# Altium project PCB_Project.PrjPcb
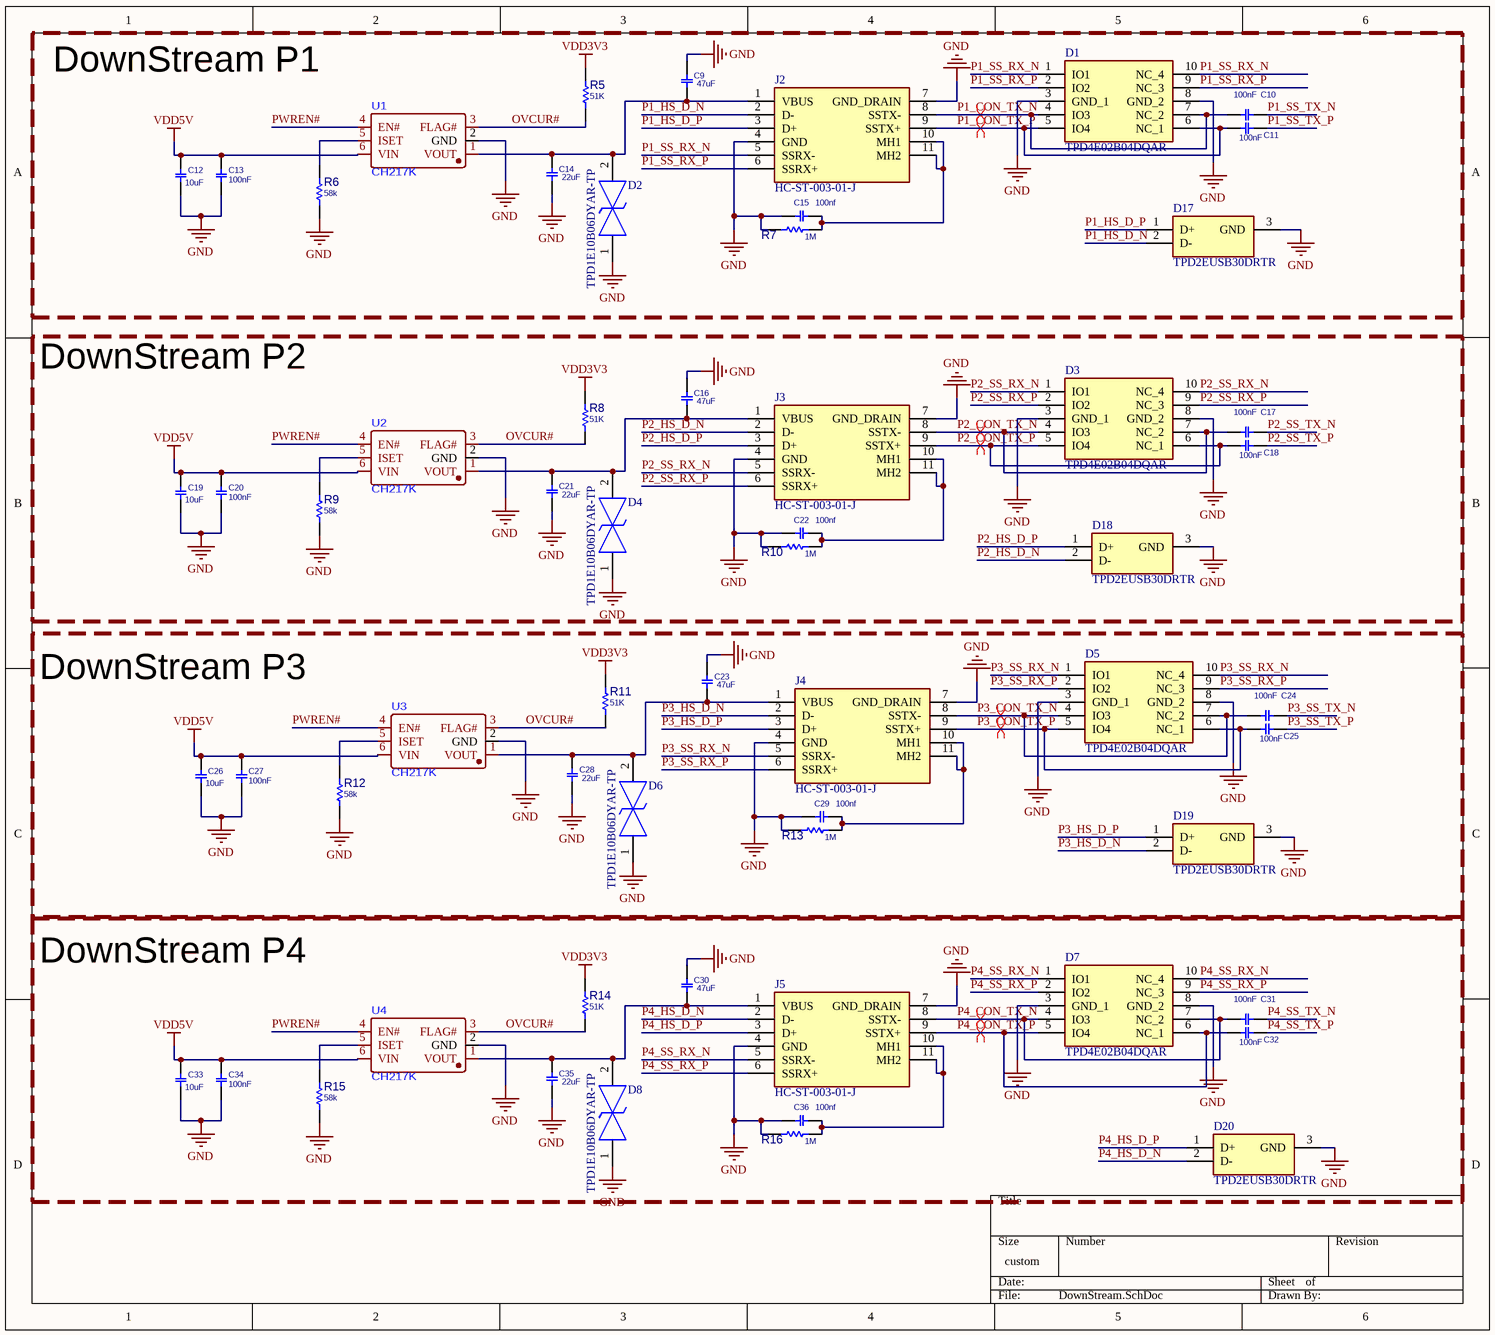
[diagram p0: DownStream.SchDoc]
4 sheets, 134 parts. Net scope: global (net labels, ports and power ports of the same name join across sheets).
Board file: PCB1.PcbDoc
Sheets:
  DownStream.SchDoc
  Power Management.SchDoc
  CH634W6G.SchDoc
  UpStream.SchDoc

## Sheet DownStream.SchDoc
size 279 x 248 mm; SheetNumber: 1; SheetTotal: 4

### Parts
C9  47uF  [C0805]
C10  100nF  [C0402]
C11  100nF  [C0402]
C12  10uF  [C0603]
C13  100nF  [C0402]
C14  22uF  [C0805]
C15  100nf  [C1812]
C16  47uF  [C0805]
C17  100nF  [C0402]
C18  100nF  [C0402]
C19  10uF  [C0603]
C20  100nF  [C0402]
C21  22uF  [C0805]
C22  100nf  [C1812]
C23  47uF  [C0805]
C24  100nF  [C0402]
C25  100nF  [C0402]
C26  10uF  [C0603]
C27  100nF  [C0402]
C28  22uF  [C0805]
C29  100nf  [C1812]
C30  47uF  [C0805]
C31  100nF  [C0402]
C32  100nF  [C0402]
C33  10uF  [C0603]
C34  100nF  [C0402]
C35  22uF  [C0805]
C36  100nf  [C1812]
D1  TPD4E02B04DQAR  [DQA(R-PUSON-N10)]
D2  TPD1E10B06DYAR-TP  [SODFL1608X77N]
D3  TPD4E02B04DQAR  [DQA(R-PUSON-N10)]
D4  TPD1E10B06DYAR-TP  [SODFL1608X77N]
D5  TPD4E02B04DQAR  [DQA(R-PUSON-N10)]
D6  TPD1E10B06DYAR-TP  [SODFL1608X77N]
D7  TPD4E02B04DQAR  [DQA(R-PUSON-N10)]
D8  TPD1E10B06DYAR-TP  [SODFL1608X77N]
D17  TPD2EUSB30DRTR  [SOTFL35P100X50-3N]
D18  TPD2EUSB30DRTR  [SOTFL35P100X50-3N]
D19  TPD2EUSB30DRTR  [SOTFL35P100X50-3N]
D20  TPD2EUSB30DRTR  [SOTFL35P100X50-3N]
J2  HC-ST-003-01-J  [GSB4111312HR]
J3  HC-ST-003-01-J  [GSB4111312HR]
J4  HC-ST-003-01-J  [GSB4111312HR]
J5  HC-ST-003-01-J  [GSB4111312HR]
R5  51K  [R0402]
R6  58k  [R0402]
R7  1M  [R0805]
R8  51K  [R0402]
R9  58k  [R0402]
R10  1M  [R0805]
R11  51K  [R0402]
R12  58k  [R0402]
R13  1M  [R0805]
R14  51K  [R0402]
R15  58k  [R0402]
R16  1M  [R0805]
U1  CH217K  [IC_IC-DP_SOT23-6L]
U2  CH217K  [IC_IC-DP_SOT23-6L]
U3  CH217K  [IC_IC-DP_SOT23-6L]
U4  CH217K  [IC_IC-DP_SOT23-6L]

### Blocks framed on the sheet
DownStream P1: C9-C15 D1 D2 D17 J2 R5-R7 U1
DownStream P2: C16-C22 D3 D4 D18 J3 R8-R10 U2
DownStream P3: C23-C29 D5 D6 D19 J4 R11-R13 U3
DownStream P4: C30-C36 D7 D8 D20 J5 R14-R16 U4

### Nets
GND: C9.2 C12.1 C13.2 C14.1 C15.1 C16.2 C19.1 C20.2 C21.1 C22.1 C23.2 C26.1 C27.2 C28.1 C29.1 C30.2 C33.1 C34.2 C35.1 C36.1 D1.3(GND_1) D1.8(GND_2) D2.1 D3.3(GND_1) D3.8(GND_2) D4.1 D5.3(GND_1) D5.8(GND_2) D6.1 D7.3(GND_1) D7.8(GND_2) D8.1 D17.3(GND) D18.3(GND) D19.3(GND) D20.3(GND) J2.4(GND) J2.7(GND_DRAIN) J3.4(GND) J3.7(GND_DRAIN) J4.4(GND) J4.7(GND_DRAIN) J5.4(GND) J5.7(GND_DRAIN) R6.2 R7.2 R9.2 R10.2 R12.2 R13.2 R15.2 R16.2 U1.2(GND) U2.2(GND) U3.2(GND) U4.2(GND)
VDD3V3: R5.1 R8.1 R11.1 R14.1  [project net AVDD3V3]
VDD5V: C12.2 C13.1 C19.2 C20.1 C26.2 C27.1 C33.2 C34.1 U1.6(VIN) U2.6(VIN) U3.6(VIN) U4.6(VIN)
OVCUR#: R5.2 R8.2 R11.2 R14.2 U1.3(FLAG#) U2.3(FLAG#) U3.3(FLAG#) U4.3(FLAG#)
P1_CON_TX_N: C10.2 D1.4(IO3) D1.7(NC_2) J2.8(SSTX-)
P1_CON_TX_P: C11.2 D1.5(IO4) D1.6(NC_1) J2.9(SSTX+)
P1_HS_D_N: D17.2(D-) J2.2(D-)
P1_HS_D_P: D17.1(D+) J2.3(D+)
P1_SS_RX_N: D1.1(IO1) D1.10(NC_4) J2.5(SSRX-)
P1_SS_RX_P: D1.2(IO2) D1.9(NC_3) J2.6(SSRX+)
P1_SS_TX_N: C10.1
P1_SS_TX_P: C11.1
P2_CON_TX_N: C17.2 D3.4(IO3) D3.7(NC_2) J3.8(SSTX-)
P2_CON_TX_P: C18.2 D3.5(IO4) D3.6(NC_1) J3.9(SSTX+)
P2_HS_D_N: D18.2(D-) J3.2(D-)
P2_HS_D_P: D18.1(D+) J3.3(D+)
P2_SS_RX_N: D3.1(IO1) D3.10(NC_4) J3.5(SSRX-)
P2_SS_RX_P: D3.2(IO2) D3.9(NC_3) J3.6(SSRX+)
P2_SS_TX_N: C17.1
P2_SS_TX_P: C18.1
P3_CON_TX_N: C24.2 D5.4(IO3) D5.7(NC_2) J4.8(SSTX-)
P3_CON_TX_P: C25.2 D5.5(IO4) D5.6(NC_1) J4.9(SSTX+)
P3_HS_D_N: D19.2(D-) J4.2(D-)
P3_HS_D_P: D19.1(D+) J4.3(D+)
P3_SS_RX_N: D5.1(IO1) D5.10(NC_4) J4.5(SSRX-)
P3_SS_RX_P: D5.2(IO2) D5.9(NC_3) J4.6(SSRX+)
P3_SS_TX_N: C24.1
P3_SS_TX_P: C25.1
P4_CON_TX_N: C31.2 D7.4(IO3) D7.7(NC_2) J5.8(SSTX-)
P4_CON_TX_P: C32.2 D7.5(IO4) D7.6(NC_1) J5.9(SSTX+)
P4_HS_D_N: D20.2(D-) J5.2(D-)
P4_HS_D_P: D20.1(D+) J5.3(D+)
P4_SS_RX_N: D7.1(IO1) D7.10(NC_4) J5.5(SSRX-)
P4_SS_RX_P: D7.2(IO2) D7.9(NC_3) J5.6(SSRX+)
P4_SS_TX_N: C31.1
P4_SS_TX_P: C32.1
PWREN#: U1.4(EN#) U2.4(EN#) U3.4(EN#) U4.4(EN#)
NetC9_1: C9.1 C14.2 D2.2 J2.1(VBUS) U1.1(VOUT)
NetC15_2: C15.2 J2.10(MH1) J2.11(MH2) R7.1
NetC16_1: C16.1 C21.2 D4.2 J3.1(VBUS) U2.1(VOUT)
NetC22_2: C22.2 J3.10(MH1) J3.11(MH2) R10.1
NetC23_1: C23.1 C28.2 D6.2 J4.1(VBUS) U3.1(VOUT)
NetC29_2: C29.2 J4.10(MH1) J4.11(MH2) R13.1
NetC30_1: C30.1 C35.2 D8.2 J5.1(VBUS) U4.1(VOUT)
NetC36_2: C36.2 J5.10(MH1) J5.11(MH2) R16.1
NetR6_1: R6.1 U1.5(ISET)
NetR9_1: R9.1 U2.5(ISET)
NetR12_1: R12.1 U3.5(ISET)
NetR15_1: R15.1 U4.5(ISET)

### Layout directives
differential pair; net class SupperSpeed; rule Differential Pairs Routing [Pref Gap = 5mil    Min Gap  = 5mil    Max Gap  = 5milPref Width = 4.347mil    Min Width  = 2.255mil    Max Width  = 4.347mil]: P1_CON_TX_N, P1_CON_TX_P, P2_CON_TX_N, P2_CON_TX_P, P3_CON_TX_N, P3_CON_TX_P, P4_CON_TX_N, P4_CON_TX_P

### Library data of the parts
C9 C14 C16 C21 C23 C28 C30 C35 = CAP_SMD_MLCC_0805
C10 C11 C13 C17 C18 C20 C24 C25 C27 C31 C32 C34 = CAP_SMD_MLCC_0402
C12 C19 C33 = CAP_SMD_MLCC_0603: CAP, MLCC, -F, -V, MATERIAL, -%, 0201
C15 C22 C29 C36 = CAP_SMD_MLCC_1812: +1kv 100nf
C26 = CAP_SMD_MLCC_0603
D1 D3 D5 D7 = TPD4E02B04DQAR: Diode; Manufacturer_Name: Texas Instruments; Datasheet Link: http://www.ti.com/lit/gpn/tpd4e02b04; Manufacturer_Part_Number: TPD4E02B04DQAR; Mouser Part Number: 595-TPD4E02B04DQAR; Mouser Price/Stock: https://www.mouser.co.uk/ProductDetail/Texas-Instruments/TPD4E02B04DQAR?qs=8%2FmU9qzJpL%2FFVYtHO1iV9g%3D%3D; Arrow Part Number: TPD4E02B04DQAR; Arrow Price/Stock: https://www.arrow.com/en/products/tpd4e02b04dqar/texas-instruments?utm_currency=USD&region=nac
D2 D4 D6 D8 = TPD1E10B06DYARQ1: TVS Diode (Bi-directional); Manufacturer_Name: Texas Instruments; Datasheet Link: https://www.ti.com/lit/ds/symlink/tpd1e10b06-q1.pdf?ts=1647960520558&ref_url=https%253A%252F%252Fwww.ti.com%252Fstore%252Fti%252Fen%252Fp%252Fproduct%252F%253Fp%253DTPD1E10B06DYARQ1%2526keyMatch%253DTPD1E10B06DYARQ1%2526tisearch%253Dsearch-everything%2526; Height: 0.77mm; Manufacturer_Part_Number: TPD1E10B06DYARQ1; Mouser Part Number: 595-TPD1E10B06DYARQ1; Mouser Price/Stock: https://www.mouser.co.uk/ProductDetail/Texas-Instruments/TPD1E10B06DYARQ1?qs=MyNHzdoqoQLC7lMK0t36jg%3D%3D; Arrow Part Number: TPD1E10B06DYARQ1; Arrow Price/Stock: https://www.arrow.com/en/products/tpd1e10b06dyarq1/texas-instruments.html?utm_currency=USD&region=nac
D17-D20 = TPD2EUSB30DRTR: TPD2EUSB30ADRTR; Manufacturer_Name: Texas Instruments; Datasheet Link: https://datasheet.datasheetarchive.com/originals/distributors/SFDatasheet-11/sf-000234749.pdf; Height: 0.5mm; Manufacturer_Part_Number: TPD2EUSB30DRTR; Mouser Part Number: 595-TPD2EUSB30DRTR; Mouser Price/Stock: https://www.mouser.co.uk/ProductDetail/Texas-Instruments/TPD2EUSB30DRTR?qs=%2Fqzd9s%252BcLd6bPJi5HXCDvw%3D%3D; Arrow Part Number: TPD2EUSB30DRTR; Arrow Price/Stock: https://www.arrow.com/en/products/tpd2eusb30drtr/texas-instruments?utm_currency=USD&region=nac
J2-J5 = GSB4111312HR: Connector; Manufacturer_Name: HCTL; Datasheet Link: https://jlc-prod-smt.oss-eu-central-1.aliyuncs.com/smtDataManualFile/8588944600697987072-C2845330.pdf?response-content-disposition=attachment%3B%20filename%3DC2845330.pdf%3B%20filename%2A%3DUTF-8%27%27C2845330.pdf&x-oss-date=20260624T131613Z&x-oss-expires=1800&x-oss-security-token=CAISgAN1q6Ft5B2yfSjIr5neLuyMobBX8Jq8VFL3t04ybct22oPs1Tz2IHhMdHJsAOodtv0%2FmmhT6PkclqRLcbhpcmfjV%2BZHzLB8qfh56zJG4J7b16cNrbH4M4H6aXeirtuwDsz9SNTCALjPD3nPii50x5bjaDymRCbLGJaViJlhHLN1Ow6jdmhpCctxLAlvo9NgFxm3D%2Fu2NQPwiWf9FVdhvhEG6Vly8qOi2MaRmFy8yFTx0b0SvJ%2BjYMrmPctoN9JnSdC5mfdzau3a1TJ84gRD0a5wkaVA1zbDs5bfISEIuUzebreLqY03dV4mOvdqIcMe8qigz88fk%2FfIioH6xyxKOexoSCnFTOiiupCcQLPyao9jLu6iayqViY7QaIOTqQohZmkAMwVOasAsI3Ngh4zF97Qt0cVNkXO9gWfLI8DtuMleWmrhyvhZYnSgc5lCkRRYwGs1287ugXlSQzo890KPDAEovaKCnZ2ZSfh7Y4sNknI6i%2Bfc2Se2MIkIaGg6%2BaKWD5sagAGaU2vJ%2BUbHVcuInMWet0dEX2Iv7ftV1FJ3rlSjwZii9OyhGbJCZVYvIkQRaKGMI1tb%2BXiUsWCR1GdB305w4Pj9RGYZ3q2pJnyDZ5Gd2q%2FQL%2Byrus7VegFb%2FfVgXDtlbRo3gaGxstKJLtvMuu%2FTomt3hknP3Pb5omGW5yvr9zftiSAA&x-oss-signature-version=OSS4-HMAC-SHA256&x-oss-credential=STS.NZkeV8LovGXWVtFSNgaDZ5FG7%2F20260624%2Feu-central-1%2Foss%2Faliyun_v4_request&x-oss-signature=348679cb6c752d500094aba1cae5179e4d919bc3f1e2f01c465e7868dab20983; Height: 7.94mm; Manufacturer_Part_Number: HC-ST-003-01-J
R5-R16 = RES_SMD_0402: RESISTOR, SMD

## Sheet Power Management.SchDoc
size A; SheetNumber: 2; SheetTotal: 4
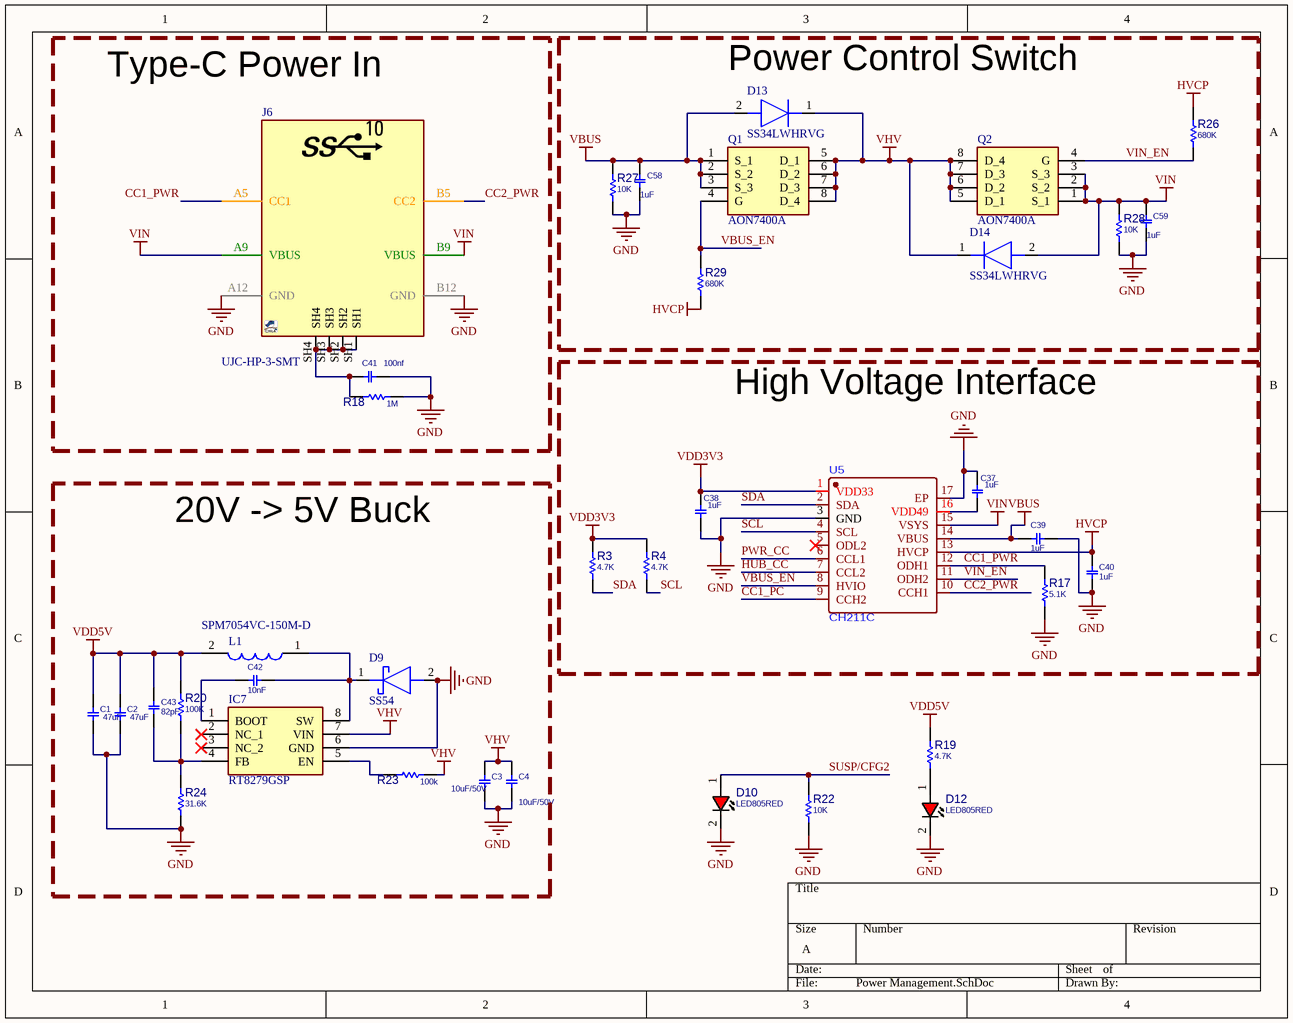
[diagram p1: Power Management.SchDoc]

### Parts
C1  47uF  [C0805]
C2  47uF  [C0805]
C3  10uF/50V  [C0805]
C4  10uF/50V  [C0805]
C37  1uF  [C0805]
C38  1uF  [C0805]
C39  1uF  [C0805]
C40  1uF  [C0805]
C41  100nf  [C1812]
C42  10nF  [C0402]
C43  82pF  [C0402]
C58  1uF  [C0402]
C59  1uF  [C0402]
D9  SS54  [DIOM5026X262N]
D10  LED805RED  [LED0805RED]
D12  LED805RED  [LED0805RED]
D13  SS34LWHRVG  [SODFL3718X102N]
D14  SS34LWHRVG  [SODFL3718X102N]
IC7  RT8279GSP  [SOIC127P600X175-8N]
J6  UJC-HP-3-SMT  [USBC_SMD_6_UJCHP3SMT]
L1  SPM7054VC-150M-D  [SPM7054VC150MD]
Q1  AON7400A  [DFN_3X3_EP]
Q2  AON7400A  [DFN_3X3_EP]
R3  4.7K  [R0402]
R4  4.7K  [R0402]
R17  5.1K  [R0402]
R18  1M  [R0805]
R19  4.7K  [R0402]
R20  100K  [R0402]
R22  10K  [R0402]
R23  100k  [R0402]
R24  31.6K  [R0402]
R26  680K  [R0402]
R27  10K  [R0402]
R28  10K  [R0402]
R29  680K  [R0402]
U5  CH211C  [QFN-16C_L2.0-W2.0-P0.40-BL-EP1.2]

### Blocks framed on the sheet
Type-C Power In: C41 J6 R18
Power Control Switch: C58 C59 D13 D14 Q1 Q2 R26-R29
High Voltage Interface: C37-C40 R3 R4 R17 U5
20V -> 5V Buck: C1-C4 C42 C43 D9 IC7 L1 R20 R23 R24

### Nets
GND: C1.1 C2.1 C3.1 C4.1 C37.2 C38.1 C39.1 C40.2 C41.2 C58.1 C59.1 D9.2(A) D10.2(CATHODE) D12.2(CATHODE) IC7.6(GND) J6.A12(GND) J6.B12(GND) R17.2 R18.1 R22.2 R24.2 R27.2 R28.2 U5.3(GND) U5.17(EP)
HVCP: C40.1 R26.2 R29.2 U5.13(HVCP)
VBUS: C39.2 C58.2 D13.2(A) Q1.1(S_1) Q1.2(S_2) Q1.3(S_3) R27.1 U5.14(VBUS)
VDD3V3: C38.2 R3.1 R4.1 U5.1(VDD33)  [project net AVDD3V3]
VDD5V: C1.2 C2.2 C43.1 L1.2 R19.1 R20.1
VHV: C3.2 C4.2 D13.1(K) D14.1(K) IC7.7(VIN) Q1.5(D_1) Q1.6(D_2) Q1.7(D_3) Q1.8(D_4) Q2.5(D_1) Q2.6(D_2) Q2.7(D_3) Q2.8(D_4) R23.1
VIN: C59.2 D14.2(A) J6.A9(VBUS) J6.B9(VBUS) Q2.1(S_1) Q2.2(S_2) Q2.3(S_3) R28.1 U5.15(VSYS)
CC1_PC: U5.9(CCH2)
CC1_PWR: J6.A5(CC1) R17.1 U5.12(ODH1)
CC2_PWR: J6.B5(CC2) U5.10(CCH1)
HUB_CC: U5.7(CCL2)
PWR_CC: U5.6(CCL1)
SCL: R4.2 U5.4(SCL)
SDA: R3.2 U5.2(SDA)
SUSP/CFG2: D10.1(ANODE) R22.1
VBUS_EN: Q1.4(G) R29.1 U5.8(HVIO)
VIN_EN: Q2.4(G) R26.1 U5.11(ODH2)
NetC37_1: C37.1 U5.16(VDD49)
NetC41_1: C41.1 J6.SH1 J6.SH2 J6.SH3 J6.SH4 R18.2
NetC42_1: C42.1 D9.1(K) IC7.8(SW) L1.1
NetC42_2: C42.2 IC7.1(BOOT)
NetC43_2: C43.2 IC7.4(FB) R20.2 R24.1
NetD12_1: D12.1(ANODE) R19.2
NetIC7_5: IC7.5(EN) R23.2

Not connected (* = marked no-connect by the designer): IC7 2(NC_1)* 3(NC_2)*; U5 5(ODL2)*

### Library data of the parts
C1-C3 C37-C40 = CAP_SMD_MLCC_0805
C4 = CAP_SMD_MLCC_0402: 50V
C41 = CAP_SMD_MLCC_1812: +1kv 100nf
C42 C43 C58 C59 = CAP_SMD_MLCC_0402
D9 = SS54: Schottky Diode; Manufacturer_Name: DIYI Elec Tech; Datasheet Link: https://datasheet.lcsc.com/szlcsc/DIYI-Elec-Tech-SS54_C84165.pdf; Height: 2.62mm; Manufacturer_Part_Number: SS54
D10 D12 = LED_SMD_0805_RED: LED, SMD, 0805, RED; DESC: DESCRIPTION; MANF_P#: MANF_PART#; PARAM2: 2.2V; MANF: MANF; ASSEMBLY: ASSEMBLY; PRICE: 36t@Javan; VALUE: LED805RED
D13 D14 = SS34LWHRVG: Diode; Manufacturer_Name: Taiwan Semiconductor; Datasheet Link: https://datasheet.datasheetarchive.com/originals/distributors/DKDS-20/389381.pdf; Height: 1.02mm; Manufacturer_Part_Number: SS34LWHRVG; Mouser Part Number: 821-SS34LWHRVG; Mouser Price/Stock: https://www.mouser.co.uk/ProductDetail/Taiwan-Semiconductor/SS34LWHRVG?qs=5aG0NVq1C4zYvYQjFNyRbA%3D%3D; Arrow Part Number: SS34LWHRVG; Arrow Price/Stock: https://www.arrow.com/en/products/ss34lwhrvg/taiwan-semiconductor?region=asia
IC7 = RT8279GSP: Integrated Circuit; Manufacturer_Name: RICHTEK; Datasheet Link: https://www.richtek.com/assets/product_file/RT8279/DS8279-01.pdf; Height: 1.753mm; Manufacturer_Part_Number: RT8279GSP
J6 = CONN_USBC_SMD_6_UJC-HP-3-SMT: CONN, USB, Type C (USB 3.1), Right-Angle, SMD; MANF: CUI Devices; PARAM2: 20v; PARAM: Power Only, 3A; Price: 0.8$; MANF_P#: UJC-HP-3-SMT; Value: UJC-HP-3-SMT
L1 = SPM7054VC-150M-D: Inductor; Manufacturer_Name: TDK; Datasheet Link: https://product.tdk.com/system/files/dam/doc/product/inductor/inductor/smd/catalog/inductor_automotive_power_spm7054vc-d_en.pdf; Height: 5.4mm; Manufacturer_Part_Number: SPM7054VC-150M-D; Mouser Part Number: 810-SPM7054VC-150M-D; Mouser Price/Stock: https://www.mouser.co.uk/ProductDetail/TDK/SPM7054VC-150M-D?qs=t7xnP681wgUXhSKXG3H9TA%3D%3D
Q1 Q2 = AON7400A: MOSFET (N-Channel); Manufacturer_Name: Alpha & Omega Semiconductors; Datasheet Link: https://www.arrow.com/en/products/aon7400a/alpha-and-omega-semiconductor; Manufacturer_Part_Number: AON7400A; Arrow Part Number: AON7400A; Arrow Price/Stock: https://www.arrow.com/en/products/aon7400a/alpha-and-omega-semiconductor.html?utm_currency=USD&region=nac
R3 R4 R17 R19 R20 R22-R24 R26-R29 = RES_SMD_0402: RESISTOR, SMD
R18 = RES_SMD_0402: RESISTOR, SMD / 0805

## Sheet CH634W6G.SchDoc
size A4; SheetNumber: 3; SheetTotal: 4
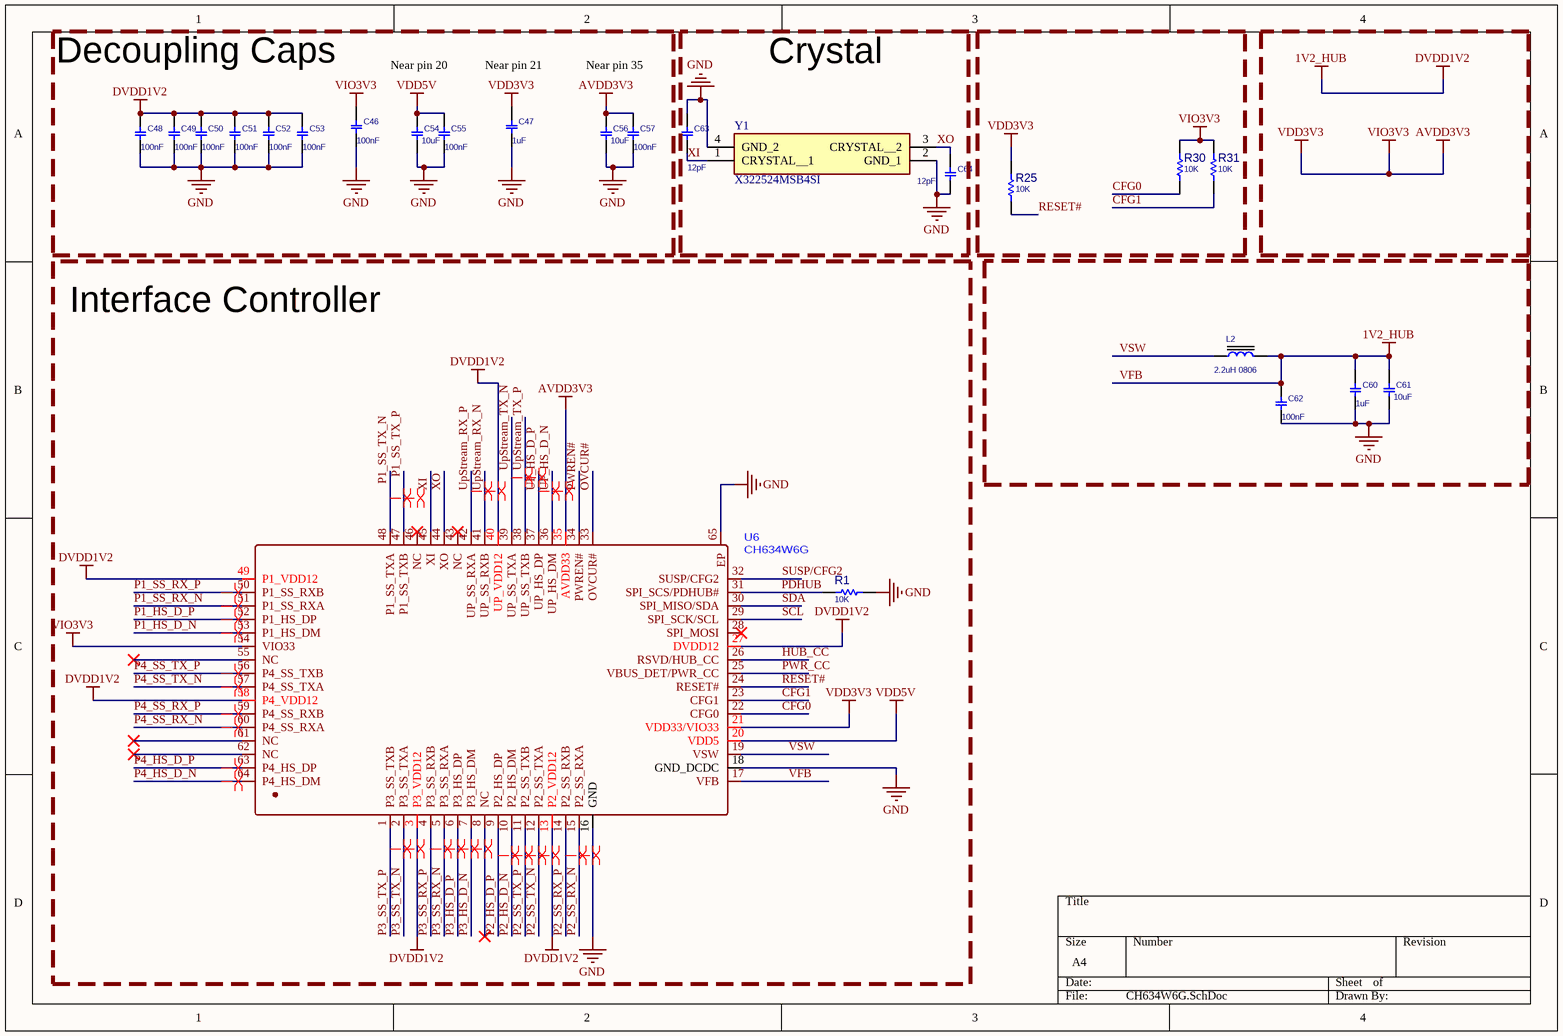
[diagram p2: CH634W6G.SchDoc]

### Parts
C46  100nF  [C0402]
C47  1uF  [C0402]
C48  100nF  [C0402]
C49  100nF  [C0402]
C50  100nF  [C0402]
C51  100nF  [C0402]
C52  100nF  [C0402]
C53  100nF  [C0402]
C54  10uF  [C0603]
C55  100nF  [C0402]
C56  10uF  [C0603]
C57  100nF  [C0402]
C60  1uF  [C0402]
C61  10uF  [C0603]
C62  100nF  [C0402]
C63  12pF  [C0402]
C64  12pF  [C0402]
L2  2.2uH 0806  [L0806]
R1  10K  [R0402]
R25  10K  [R0402]
R30  10K  [R0402]
R31  10K  [R0402]
U6  CH634W6G  [CH634w]
Y1  X322524MSB4SI  [X1E0000210264]

### Blocks framed on the sheet
Decoupling Caps: C46-C57
Crystal: C63 C64 Y1
Interface Controller: R1 U6

### Nets
AVDD3V3: C46.2 C47.2 C56.2 C57.2 R25.1 R30.1 R31.1 U6.21(VDD33/VIO33) U6.35(AVDD33) U6.54(VIO33)  [also labelled VDD3V3, VIO3V3]
GND: C46.1 C47.1 C48.1 C49.1 C50.1 C51.1 C52.1 C53.1 C54.1 C55.1 C56.1 C57.1 C60.1 C61.1 C62.1 C63.2 C64.2 R1.2 U6.16(GND) U6.18(GND_DCDC) U6.65(EP) Y1.2(GND_1) Y1.4(GND_2)
VDD5V: C54.2 C55.2 U6.20(VDD5)
VFB: C48.2 C49.2 C50.2 C51.2 C52.2 C53.2 C60.2 C61.2 C62.2 L2.2 U6.3(P3_VDD12) U6.13(P2_VDD12) U6.17(VFB) U6.27(DVDD12) U6.40(UP_VDD12) U6.49(P1_VDD12) U6.58(P4_VDD12)  [also labelled 1V2_HUB, DVDD1V2]
CFG0: R30.2 U6.22(CFG0)
CFG1: R31.2 U6.23(CFG1)
HUB_CC: U6.26(RSVD/HUB_CC)
OVCUR#: U6.33(OVCUR#)
P1_HS_D_N: U6.53(P1_HS_DM)
P1_HS_D_P: U6.52(P1_HS_DP)
P1_SS_RX_N: U6.51(P1_SS_RXA)
P1_SS_RX_P: U6.50(P1_SS_RXB)
P1_SS_TX_N: U6.48(P1_SS_TXA)
P1_SS_TX_P: U6.47(P1_SS_TXB)
P2_HS_D_N: U6.10(P2_HS_DM)
P2_HS_D_P: U6.9(P2_HS_DP)
P2_SS_RX_N: U6.15(P2_SS_RXA)
P2_SS_RX_P: U6.14(P2_SS_RXB)
P2_SS_TX_N: U6.12(P2_SS_TXA)
P2_SS_TX_P: U6.11(P2_SS_TXB)
P3_HS_D_N: U6.7(P3_HS_DM)
P3_HS_D_P: U6.6(P3_HS_DP)
P3_SS_RX_N: U6.5(P3_SS_RXA)
P3_SS_RX_P: U6.4(P3_SS_RXB)
P3_SS_TX_N: U6.2(P3_SS_TXA)
P3_SS_TX_P: U6.1(P3_SS_TXB)
P4_HS_D_N: U6.64(P4_HS_DM)
P4_HS_D_P: U6.63(P4_HS_DP)
P4_SS_RX_N: U6.60(P4_SS_RXA)
P4_SS_RX_P: U6.59(P4_SS_RXB)
P4_SS_TX_N: U6.57(P4_SS_TXA)
P4_SS_TX_P: U6.56(P4_SS_TXB)
PDHUB: R1.1 U6.31(SPI_SCS/PDHUB#)
PWR_CC: U6.25(VBUS_DET/PWR_CC)
PWREN#: U6.34(PWREN#)
RESET#: R25.2 U6.24(RESET#)
SCL: U6.29(SPI_SCK/SCL)
SDA: U6.30(SPI_MISO/SDA)
SUSP/CFG2: U6.32(SUSP/CFG2)
UP_HS_D_N: U6.36(UP_HS_DM)
UP_HS_D_P: U6.37(UP_HS_DP)
UpStream_RX_N: U6.41(UP_SS_RXB)
UpStream_RX_P: U6.42(UP_SS_RXA)
UpStream_TX_N: U6.39(UP_SS_TXA)
UpStream_TX_P: U6.38(UP_SS_TXB)
VSW: L2.1 U6.19(VSW)
XI: C63.1 U6.45(XI) Y1.1(CRYSTAL__1)
XO: C64.1 U6.44(XO) Y1.3(CRYSTAL__2)

Not connected (* = marked no-connect by the designer): U6 8(NC)* 28(SPI_MOSI)* 43(NC)* 46(NC)* 55(NC)* 61(NC)* 62(NC)*

### Layout directives
differential pair; rule Differential Pairs Routing [Pref Gap = 5mil    Min Gap  = 5mil    Max Gap  = 5milPref Width = 4.347mil    Min Width  = 2.255mil    Max Width  = 4.347mil]; differential pair class SuperSpeed: P1_HS_D_N, P1_HS_D_P, P1_SS_RX_N, P1_SS_RX_P, P1_SS_TX_N, P1_SS_TX_P, P2_HS_D_N, P2_HS_D_P, P2_SS_RX_N, P2_SS_RX_P, P2_SS_TX_N, P2_SS_TX_P, P3_HS_D_N, P3_HS_D_P, P3_SS_RX_N, P3_SS_RX_P, P3_SS_TX_N, P3_SS_TX_P, P4_HS_D_N, P4_HS_D_P, P4_SS_RX_N, P4_SS_RX_P, P4_SS_TX_N, P4_SS_TX_P, UP_HS_D_N, UP_HS_D_P, UpStream_RX_N, UpStream_RX_P, UpStream_TX_N, UpStream_TX_P

### Notes on the sheet
- Near pin 20
- Near pin 21
- Near pin 35

### Library data of the parts
C46-C53 C55 C57 C60 C62-C64 = CAP_SMD_MLCC_0402
C54 C56 C61 = CAP_SMD_MLCC_0603
L2 = IND_SMD_1uH_2.3A_0806: SLW201610S2R2MST
R1 R25 R30 R31 = RES_SMD_0402: RESISTOR, SMD
Y1 = X1E0000210264: Crystal or Oscillator; Manufacturer_Part_Number: X322524MSB4SI

## Sheet UpStream.SchDoc
size A; SheetNumber: 4; SheetTotal: 4
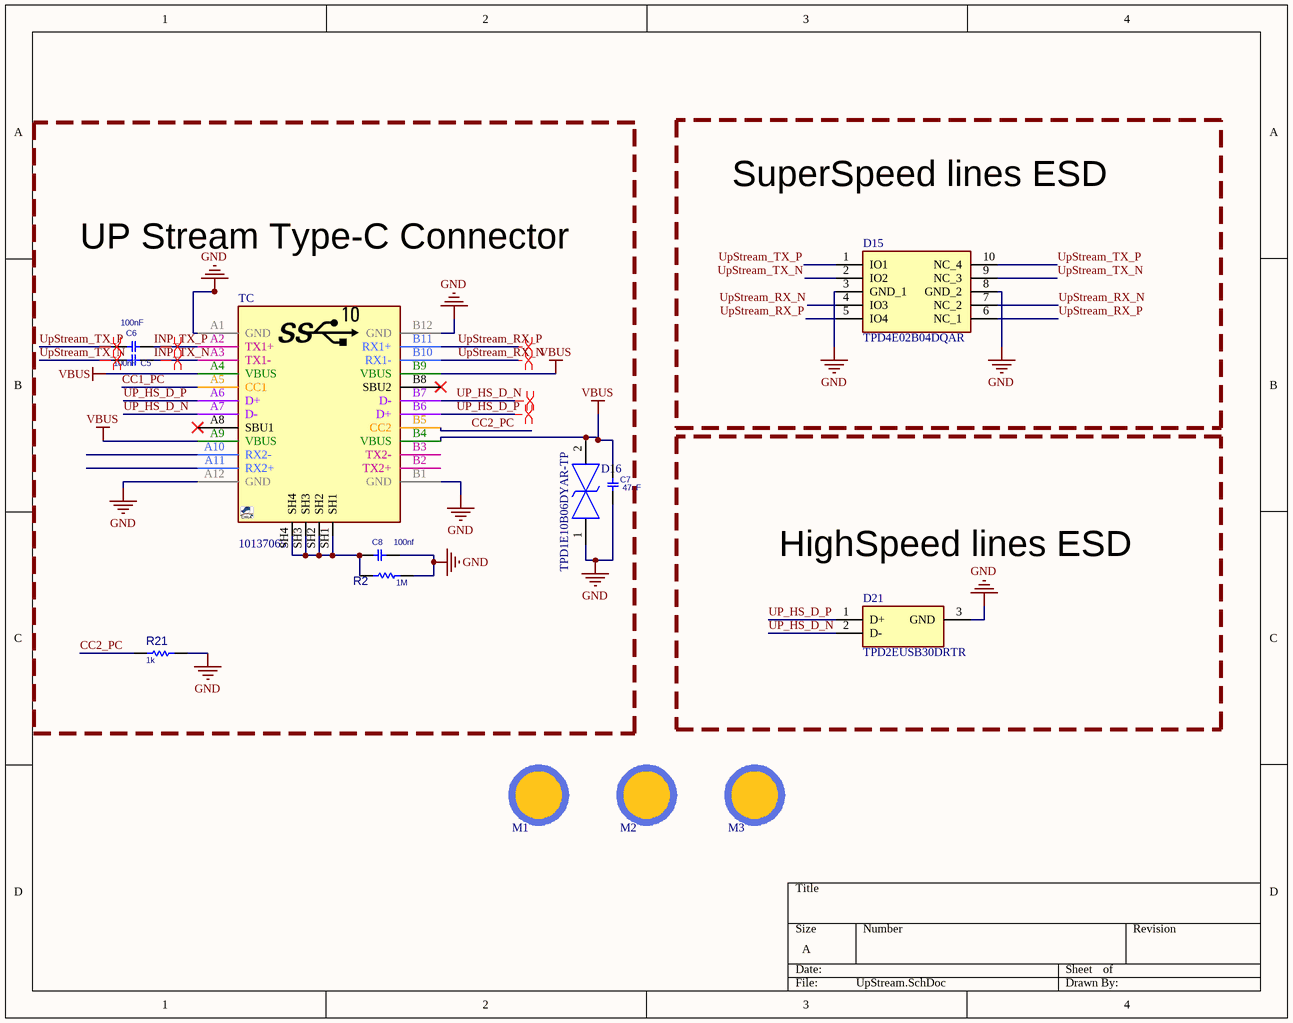
[diagram p3: UpStream.SchDoc]

### Parts
C5  100nF  [C0402]
C6  100nF  [C0402]
C7  47uF  [C0805]
C8  100nf  [C1812]
D15  TPD4E02B04DQAR  [DQA(R-PUSON-N10)]
D16  TPD1E10B06DYAR-TP  [SODFL1608X77N]
D21  TPD2EUSB30DRTR  [SOTFL35P100X50-3N]
M1  DNP/MH  [PSPMH2]  (value not drawn)  (no BOM)
M2  DNP/MH  [PSPMH2]  (value not drawn)  (no BOM)
M3  DNP/MH  [PSPMH2]  (value not drawn)  (no BOM)
R2  1M  [R0805]
R21  1k  [R0402]
TC  10137065  [USBC_HYB_UJ31CHG2SMT]

### Blocks framed on the sheet
UP Stream Type-C Connector: C5-C8 D16 R2 R21 TC
SuperSpeed lines ESD: D15
HighSpeed lines ESD: D21

### Nets
GND: C7.1 C8.2 D15.3(GND_1) D15.8(GND_2) D16.1 D21.3(GND) R2.1 R21.2 TC.A1(GND) TC.A12(GND) TC.B1(GND) TC.B12(GND)
VBUS: C7.2 D16.2 TC.A4(VBUS) TC.A9(VBUS) TC.B4(VBUS) TC.B9(VBUS)
CC1_PC: TC.A5(CC1)
CC2_PC: R21.1 TC.B5(CC2)
INP_TX_N: C5.2 TC.A3(TX1-)
INP_TX_P: C6.2 TC.A2(TX1+)
UP_HS_D_N: D21.2(D-) TC.A7(D-) TC.B7(D-)
UP_HS_D_P: D21.1(D+) TC.A6(D+) TC.B6(D+)
UpStream_RX_N: D15.4(IO3) D15.7(NC_2) TC.B10(RX1-)
UpStream_RX_P: D15.5(IO4) D15.6(NC_1) TC.B11(RX1+)
UpStream_TX_N: C5.1 D15.2(IO2) D15.9(NC_3)
UpStream_TX_P: C6.1 D15.1(IO1) D15.10(NC_4)
NetC8_1: C8.1 R2.2 TC.SH1 TC.SH2 TC.SH3 TC.SH4

Not connected (* = marked no-connect by the designer): TC A8(SBU1)* A10(RX2-) A11(RX2+) B2(TX2+) B3(TX2-) B8(SBU2)*

### Layout directives
differential pair; net class SupperSpeed; rule Differential Pairs Routing [Pref Gap = 5mil    Min Gap  = 5mil    Max Gap  = 5milPref Width = 4.347mil    Min Width  = 2.255mil    Max Width  = 4.347mil]: INP_TX_N, INP_TX_P, UpStream_RX_P, UpStream_TX_N, UpStream_TX_P
differential pair; net class SupperSpeed; rule Differential Pairs Routing [Pref Gap = 5mil    Min Gap  = 5mil    Max Gap  = 5milPref Width = 4.347mil    Min Width  = 2.255mil    Max Width  = 4.347mil]; rule Differential Pairs Routing [Pref Gap = 5mil    Min Gap  = 5mil    Max Gap  = 5milPref Width = 4.347mil    Min Width  = 2.255mil    Max Width  = 4.347mil]: UpStream_RX_N
differential pair: UP_HS_D_N, UP_HS_D_P

### Library data of the parts
C5 C6 = CAP_SMD_MLCC_0402
C7 = CAP_SMD_MLCC_0805
C8 = CAP_SMD_MLCC_1812: +1kv 100nf
D15 = TPD4E02B04DQAR: as D1 on sheet DownStream; Datasheet Link: http://www.ti.com/lit/gpn/tpd4e02b04; Manufacturer_Part_Number: TPD4E02B04DQAR; Mouser Part Number: 595-TPD4E02B04DQAR; Mouser Price/Stock: https://www.mouser.co.uk/ProductDetail/Texas-Instruments/TPD4E02B04DQAR?qs=8%2FmU9qzJpL%2FFVYtHO1iV9g%3D%3D; Arrow Part Number: TPD4E02B04DQAR; Arrow Price/Stock: https://www.arrow.com/en/products/tpd4e02b04dqar/texas-instruments?utm_currency=USD&region=nac
D16 = TPD1E10B06DYARQ1: as D2 on sheet DownStream; Datasheet Link: https://www.ti.com/lit/ds/symlink/tpd1e10b06-q1.pdf?ts=1647960520558&ref_url=https%253A%252F%252Fwww.ti.com%252Fstore%252Fti%252Fen%252Fp%252Fproduct%252F%253Fp%253DTPD1E10B06DYARQ1%2526keyMatch%253DTPD1E10B06DYARQ1%2526tisearch%253Dsearch-everything%2526; Height: 0.77mm; Manufacturer_Part_Number: TPD1E10B06DYARQ1; Mouser Part Number: 595-TPD1E10B06DYARQ1; Mouser Price/Stock: https://www.mouser.co.uk/ProductDetail/Texas-Instruments/TPD1E10B06DYARQ1?qs=MyNHzdoqoQLC7lMK0t36jg%3D%3D; Arrow Part Number: TPD1E10B06DYARQ1; Arrow Price/Stock: https://www.arrow.com/en/products/tpd1e10b06dyarq1/texas-instruments.html?utm_currency=USD&region=nac
D21 = TPD2EUSB30DRTR: as D17 on sheet DownStream; Datasheet Link: https://datasheet.datasheetarchive.com/originals/distributors/SFDatasheet-11/sf-000234749.pdf; Height: 0.5mm; Manufacturer_Part_Number: TPD2EUSB30DRTR; Mouser Part Number: 595-TPD2EUSB30DRTR; Mouser Price/Stock: https://www.mouser.co.uk/ProductDetail/Texas-Instruments/TPD2EUSB30DRTR?qs=%2Fqzd9s%252BcLd6bPJi5HXCDvw%3D%3D; Arrow Part Number: TPD2EUSB30DRTR; Arrow Price/Stock: https://www.arrow.com/en/products/tpd2eusb30drtr/texas-instruments?utm_currency=USD&region=nac
M1-M3 = PSPMH2: Plastic Spacer mouting, Hole 2mm; ASSEMBLY: DNP; VALUE: DNP/MH
R2 R21 = RES_SMD_0402: RESISTOR, SMD
TC = CONN_USBC_SMD_10137065: CONN, USB, Type C, USB 3.1 Gen 1, Right-Angle, SMD; MANF: Amphenol; MANF_P#: 10137065-00021LF; PARAM: 5A; Price: None; Value: 10137065

## Nets that join several sheets
AVDD3V3: DownStream (R5.1 R8.1 R11.1 R14.1), Power Management (C38.2 R3.1 R4.1 U5.1), CH634W6G (10 pins)
GND: DownStream (56 pins), Power Management (25 pins), CH634W6G (23 pins), UpStream (12 pins)
VBUS: Power Management (8 pins), UpStream (6 pins)
VDD5V: DownStream (12 pins), Power Management (6 pins), CH634W6G (C54.2 C55.2 U6.20)
CC1_PC: Power Management (U5.9), UpStream (TC.A5)
HUB_CC: Power Management (U5.7), CH634W6G (U6.26)
OVCUR#: DownStream (8 pins), CH634W6G (U6.33)
P1_HS_D_N: DownStream (D17.2 J2.2), CH634W6G (U6.53)
P1_HS_D_P: DownStream (D17.1 J2.3), CH634W6G (U6.52)
P1_SS_RX_N: DownStream (D1.1 D1.10 J2.5), CH634W6G (U6.51)
P1_SS_RX_P: DownStream (D1.2 D1.9 J2.6), CH634W6G (U6.50)
P1_SS_TX_N: DownStream (C10.1), CH634W6G (U6.48)
P1_SS_TX_P: DownStream (C11.1), CH634W6G (U6.47)
P2_HS_D_N: DownStream (D18.2 J3.2), CH634W6G (U6.10)
P2_HS_D_P: DownStream (D18.1 J3.3), CH634W6G (U6.9)
P2_SS_RX_N: DownStream (D3.1 D3.10 J3.5), CH634W6G (U6.15)
P2_SS_RX_P: DownStream (D3.2 D3.9 J3.6), CH634W6G (U6.14)
P2_SS_TX_N: DownStream (C17.1), CH634W6G (U6.12)
P2_SS_TX_P: DownStream (C18.1), CH634W6G (U6.11)
P3_HS_D_N: DownStream (D19.2 J4.2), CH634W6G (U6.7)
P3_HS_D_P: DownStream (D19.1 J4.3), CH634W6G (U6.6)
P3_SS_RX_N: DownStream (D5.1 D5.10 J4.5), CH634W6G (U6.5)
P3_SS_RX_P: DownStream (D5.2 D5.9 J4.6), CH634W6G (U6.4)
P3_SS_TX_N: DownStream (C24.1), CH634W6G (U6.2)
P3_SS_TX_P: DownStream (C25.1), CH634W6G (U6.1)
P4_HS_D_N: DownStream (D20.2 J5.2), CH634W6G (U6.64)
P4_HS_D_P: DownStream (D20.1 J5.3), CH634W6G (U6.63)
P4_SS_RX_N: DownStream (D7.1 D7.10 J5.5), CH634W6G (U6.60)
P4_SS_RX_P: DownStream (D7.2 D7.9 J5.6), CH634W6G (U6.59)
P4_SS_TX_N: DownStream (C31.1), CH634W6G (U6.57)
P4_SS_TX_P: DownStream (C32.1), CH634W6G (U6.56)
PWR_CC: Power Management (U5.6), CH634W6G (U6.25)
PWREN#: DownStream (U1.4 U2.4 U3.4 U4.4), CH634W6G (U6.34)
SCL: Power Management (R4.2 U5.4), CH634W6G (U6.29)
SDA: Power Management (R3.2 U5.2), CH634W6G (U6.30)
SUSP/CFG2: Power Management (D10.1 R22.1), CH634W6G (U6.32)
UP_HS_D_N: CH634W6G (U6.36), UpStream (D21.2 TC.A7 TC.B7)
UP_HS_D_P: CH634W6G (U6.37), UpStream (D21.1 TC.A6 TC.B6)
UpStream_RX_N: CH634W6G (U6.41), UpStream (D15.4 D15.7 TC.B10)
UpStream_RX_P: CH634W6G (U6.42), UpStream (D15.5 D15.6 TC.B11)
UpStream_TX_N: CH634W6G (U6.39), UpStream (C5.1 D15.2 D15.9)
UpStream_TX_P: CH634W6G (U6.38), UpStream (C6.1 D15.1 D15.10)